# Altium project 5.2 - HF_Transducer_Voltage_Sensor.PrjPcb
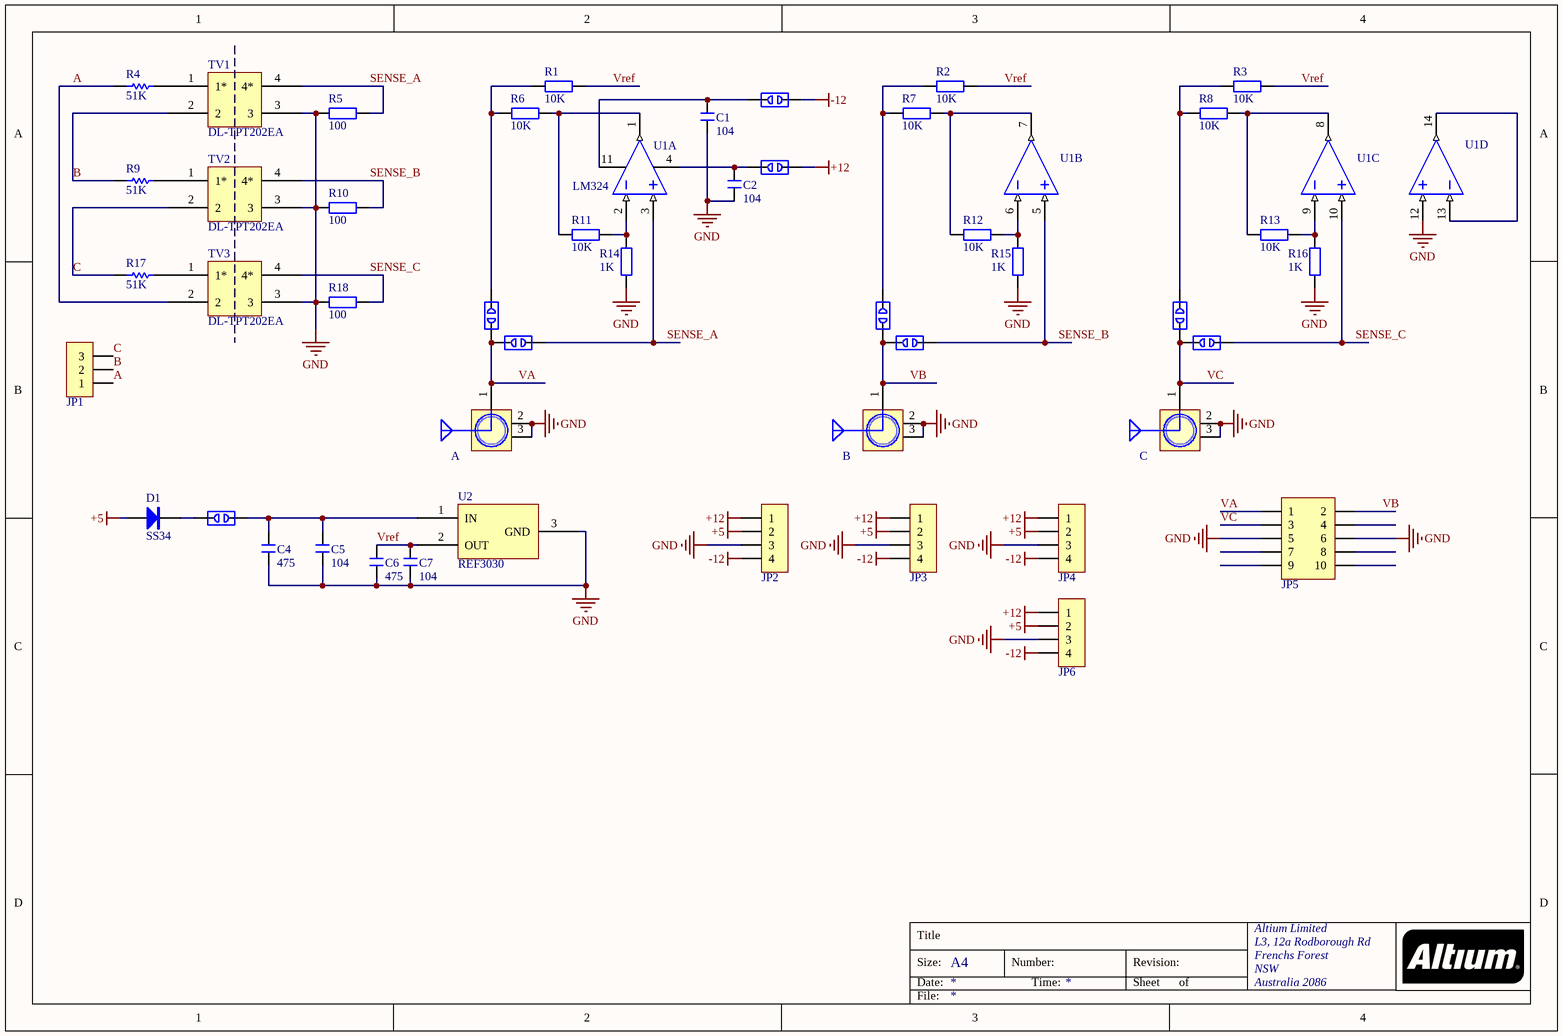
[diagram p0: HF_Voltage_Transformer.SchDoc]
1 sheet, 48 parts. Net scope: global (net labels, ports and power ports of the same name join across sheets).
Board file: HF_Voltage_Transformer.PcbDoc

## Sheet HF_Voltage_Transformer.SchDoc
size A4; Organization: Altium Limited; Address1: L3, 12a Rodborough Rd; Address2: Frenchs Forest; Address3: NSW; Address4: Australia 2086

### Parts
A  SMA WIFI 天线接口  [SMA-KE-LI]  (value not drawn)
B  SMA WIFI 天线接口  [SMA-KE-LI]  (value not drawn)
C  SMA WIFI 天线接口  [SMA-KE-LI]  (value not drawn)
C1  104  [C 0805_L]
C2  104  [C 0805_L]
C4  475  [C 0805_L]
C5  104  [C 0805_L]
C6  475  [C 0805_L]
C7  104  [C 0805_L]
D1  SS34  [SMA]
DE1  DEBUG PAD  [DEBUG_B]  (value not drawn)
DE2  DEBUG PAD  [DEBUG_B]  (value not drawn)
DE3  DEBUG PAD  [DEBUG_B]  (value not drawn)
DE4  DEBUG PAD  [DEBUG_B]  (value not drawn)
DE5  DEBUG PAD  [DEBUG_B]  (value not drawn)
DE6  DEBUG PAD  [DEBUG_B]  (value not drawn)
DE7  DEBUG PAD  [DEBUG_B]  (value not drawn)
DE8  DEBUG PAD  [DEBUG_B]  (value not drawn)
DE9  DEBUG PAD  [DEBUG_B]  (value not drawn)
JP1  HDR-1X3  [KF7620-3P]  (value not drawn)
JP2  HDR-1X4  [KF2510-LI-4P]  (value not drawn)
JP3  HDR-1X4  [KF2510-LI-4P]  (value not drawn)
JP4  HDR-1X4  [KF2510-LI-4P]  (value not drawn)
JP5  Header 5X2  [IDC2.54-LI-2x5P]  (value not drawn)
JP6  HDR-1X4  [KF2510-LI-4P]  (value not drawn)
R1  10K  [R 0805_L]
R2  10K  [R 0805_L]
R3  10K  [R 0805_L]
R4  51K  [RS 2W-V6]
R5  100  [R 0805_M]
R6  10K  [R 0805_L]
R7  10K  [R 0805_L]
R8  10K  [R 0805_L]
R9  51K  [RS 2W-V6]
R10  100  [R 0805_M]
R11  10K  [R 0805_L]
R12  10K  [R 0805_L]
R13  10K  [R 0805_L]
R14  1K  [R 0805_L]
R15  1K  [R 0805_L]
R16  1K  [R 0805_L]
R17  51K  [RS 2W-V6]
R18  100  [R 0805_M]
TV1  DL-TPT202EA  [DL-TPT202EA]
TV2  DL-TPT202EA  [DL-TPT202EA]
TV3  DL-TPT202EA  [DL-TPT202EA]
U1  LM324  [SOIC-14]  (parts A,B,C,D of 4)
U2  REF3030  [SOT23-3L]

### Nets
+5: D1.1(A) JP2.2 JP3.2 JP4.2 JP6.2
+12: DE2.1 JP2.1 JP3.1 JP4.1 JP6.1
-12: DE1.1 JP2.4 JP3.4 JP4.4 JP6.4
GND: A.2(GND) A.3(GND) B.2(GND) B.3(GND) C.2(GND) C.3(GND) C1.1 C2.1 C4.1 C5.1 C6.1 C7.1 JP2.3 JP3.3 JP4.3 JP5.5 JP5.6 JP6.3 R5.1 R10.1 R14.1 R15.1 R16.1 R18.1 TV1.3 TV2.3 TV3.3 U1.12(IN+) U2.3(GND)
A: JP1.1 R4.1 TV3.2
B: JP1.2 R9.1 TV1.2
C: JP1.3 R17.1 TV2.2
SENSE_A: DE6.1 R5.2 TV1.4(4*) U1.3(IN+)
SENSE_B: DE7.1 R10.2 TV2.4(4*) U1.5(IN+)
SENSE_C: DE8.1 R18.2 TV3.4(4*) U1.10(IN+)
VA: A.1(ANT) DE3.1 DE6.2 JP5.1
VB: B.1(ANT) DE4.1 DE7.2 JP5.2
VC: C.1(ANT) DE5.1 DE8.2 JP5.3
Vref: C6.2 C7.2 R1.1 R2.1 R3.1 U2.2(OUT)
NetC1_2: C1.2 DE1.2 U1.11(V-)
NetC2_2: C2.2 DE2.2 U1.4(V+)
NetC4_2: C4.2 C5.2 DE9.2 U2.1(IN)
NetD1_2: D1.2(K) DE9.1
NetDE3_2: DE3.2 R1.2 R6.1
NetDE4_2: DE4.2 R2.2 R7.1
NetDE5_2: DE5.2 R3.2 R8.1
NetR4_2: R4.2 TV1.1(1*)
NetR6_2: R6.2 R11.1 U1.1(OUT)
NetR7_2: R7.2 R12.1 U1.7(OUT)
NetR8_2: R8.2 R13.1 U1.8(OUT)
NetR9_2: R9.2 TV2.1(1*)
NetR11_2: R11.2 R14.2 U1.2(IN-)
NetR12_2: R12.2 R15.2 U1.6(IN-)
NetR13_2: R13.2 R16.2 U1.9(IN-)
NetR17_2: R17.2 TV3.1(1*)
NetU1_13: U1.13(IN-) U1.14(OUT)

Not connected (* = marked no-connect by the designer): JP5 4 7 8 9 10

### Notes on the sheet
- Title
- Size:
- Date:
- A4
- Number:
- Time:
- Revision:
- Sheet
- of
- File:

### Library data of the parts
A B C = SMA WIFI: SMA-2.4G射频天线接口; 淘宝ID: 小糖豆的小窝窝; BOM名称: SMA-2.4G射频天线接口; 下单链接: https://item.taobao.com/item.htm?ft=t&id=613637044352
C1 C2 C4-C7 = C: 贴片电容; 淘宝ID: 小糖豆的小窝窝; BOM名称: 贴片电容; 下单链接: https://item.taobao.com/item.htm?ft=t&id=613637044352
D1 = 1N4007: 整流二极管; 淘宝ID: 小糖豆的小窝窝; BOM名称: 整流二极管; 下单链接: https://item.taobao.com/item.htm?ft=t&id=613637044352
DE1-DE9 = DEBUG: 调试断点焊盘; 淘宝ID: 小糖豆的小窝窝; BOM名称: 调试断点焊盘; 下单链接: https://item.taobao.com/item.htm?ft=t&id=613637044352
JP1 = Header 3: 3P接插件; 淘宝ID: 小糖豆的小窝窝; BOM名称: 3P接插件; 下单链接: https://item.taobao.com/item.htm?ft=t&id=613637044352
JP2-JP4 JP6 = Header 4: 4P接插件; 淘宝ID: 小糖豆的小窝窝; BOM名称: 4P接插件; 下单链接: https://item.taobao.com/item.htm?ft=t&id=613637044352
JP5 = Header 5X2: 5*2P接插件; 淘宝ID: 小糖豆的小窝窝; BOM名称: 5*2P接插件; 下单链接: https://item.taobao.com/item.htm?ft=t&id=613637044352
R1-R3 R5-R8 R10-R16 R18 = R: 贴片电阻; 淘宝ID: 小糖豆的小窝窝; BOM名称: 贴片电阻; 下单链接: https://item.taobao.com/item.htm?ft=t&id=613637044352
R4 R9 R17 = Res: 色环电阻; 淘宝ID: 小糖豆的小窝窝; BOM名称: 色环电阻; 下单链接: https://item.taobao.com/item.htm?ft=t&id=613637044352
TV1-TV3 = DL-TPT202EA: 高频电压互感器 - 南京向上 - 2mA/2mA
U1 = LM324: 4路运放; 淘宝ID: 小糖豆的小窝窝; Alias1: https://item.taobao.com/item.htm?ft=t&id=613637044352; BOM名称: 4路运放